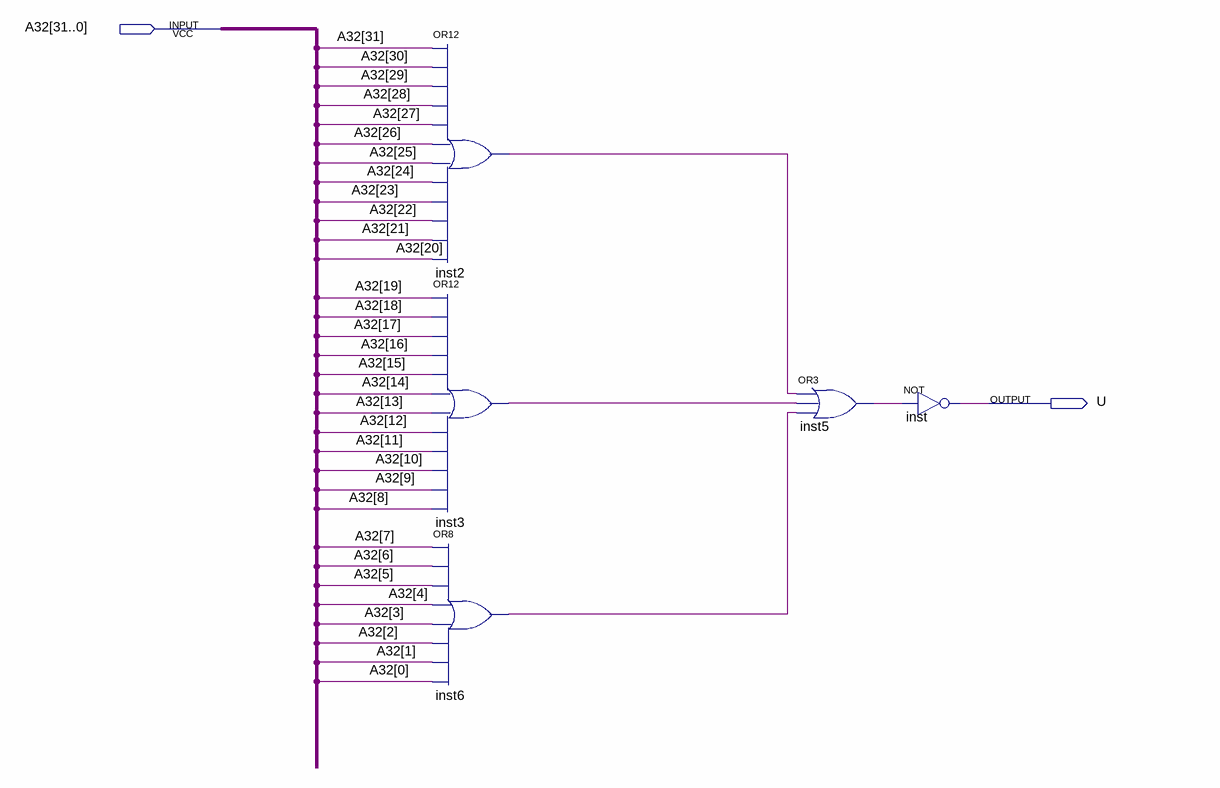
[diagram p0: schematic sheet]
// Quartus schematic outputsignal.bdf as structural Verilog: 5 symbols, 2 pins
module outputsignal (
  input  [31:0] A32,
  output U
);

  wire inst2_out, inst3_out, inst5_out, inst6_out;

  or inst2 (inst2_out, A32[31], A32[30], A32[29], A32[28], A32[27], A32[26], A32[25], A32[24], A32[23], A32[22], A32[21], A32[20]);
  or inst3 (inst3_out, A32[19], A32[18], A32[17], A32[16], A32[15], A32[14], A32[13], A32[12], A32[11], A32[10], A32[9], A32[8]);
  or inst6 (inst6_out, A32[7], A32[6], A32[5], A32[4], A32[3], A32[2], A32[1], A32[0]);
  or inst5 (inst5_out, inst2_out, inst3_out, inst6_out);
  not inst (U, inst5_out);
endmodule
